# Altium project PCB_Project3.PrjPCB
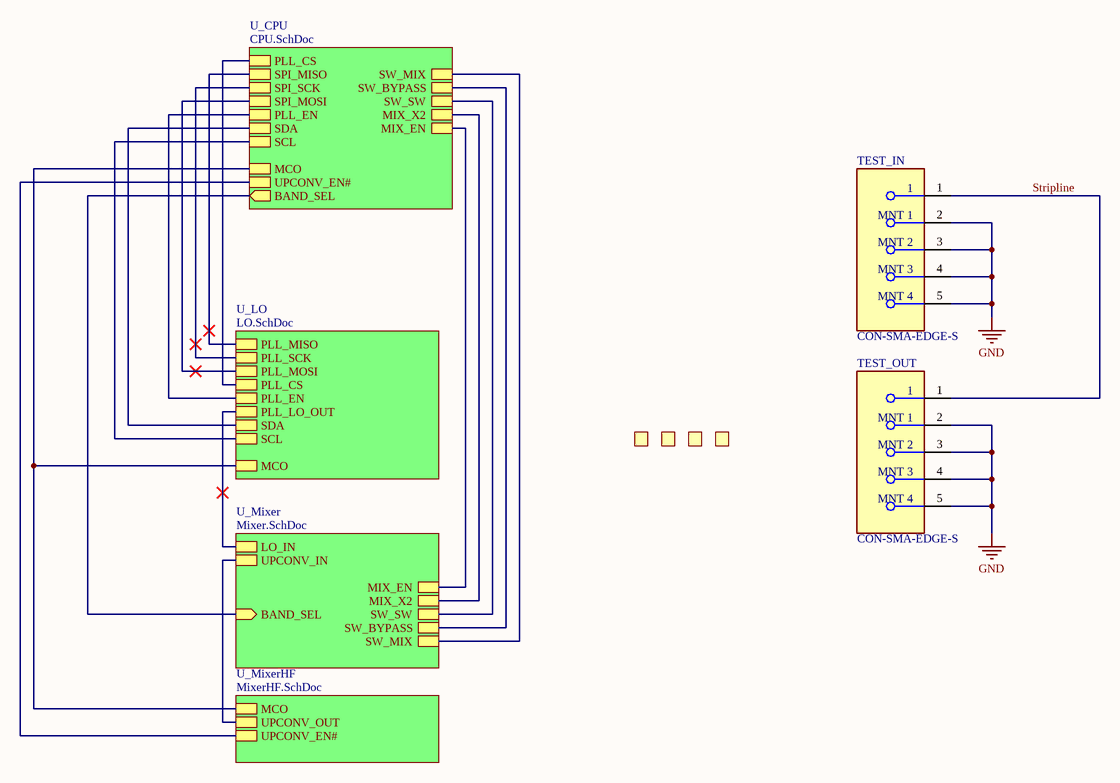
[diagram p0: Toplevel.SchDoc]
4 sheets, 115 parts. Net scope: hierarchical (ports join the sheet entries above them; power ports are global).
Board files: imped_control.PcbDoc, Template2.PcbDoc, imped50.PcbDoc
Sheets:
  Toplevel.SchDoc
    U_CPU = CPU.SchDoc
    U_Mixer = Mixer.SchDoc
    U_LO = LO.SchDoc

## Sheet Toplevel.SchDoc
size A4

### Parts
H1  MOUNTHOLE_3MM  [MOUNT_3MM]  (value not drawn)
H2  MOUNTHOLE_3MM  [MOUNT_3MM]  (value not drawn)
H3  MOUNTHOLE_3MM  [MOUNT_3MM]  (value not drawn)
H4  MOUNTHOLE_3MM  [MOUNT_3MM]  (value not drawn)
TEST_IN  CON-SMA-EDGE-S  [FP-CON-SMA-EDGE-S-MFG]
TEST_OUT  CON-SMA-EDGE-S  [FP-CON-SMA-EDGE-S-MFG]

### Sub-sheets
U_CPU = CPU.SchDoc: PLL_CS, SPI_MISO, SPI_SCK, SPI_MOSI, PLL_EN, SDA, SCL, MCO, UPCONV_EN#, SW_MIX, SW_BYPASS, SW_SW, MIX_X2, MIX_EN, BAND_SEL (out)
U_LO = LO.SchDoc: PLL_MISO, PLL_SCK, PLL_MOSI, PLL_CS, PLL_EN, PLL_LO_OUT, SDA, SCL, MCO
U_Mixer = Mixer.SchDoc: LO_IN, UPCONV_IN, MIX_EN, MIX_X2, SW_SW, SW_BYPASS, SW_MIX, BAND_SEL (in)
U_MixerHF = MixerHF.SchDoc (file not in this document): MCO, UPCONV_OUT, UPCONV_EN#

### Nets
GND: TEST_IN.2(MNT_1) TEST_IN.3(MNT_2) TEST_IN.4(MNT_3) TEST_IN.5(MNT_4) TEST_OUT.2(MNT_1) TEST_OUT.3(MNT_2) TEST_OUT.4(MNT_3) TEST_OUT.5(MNT_4)
BAND_SEL: sheet U_CPU/BAND_SEL, sheet U_Mixer/BAND_SEL
CPU_SCL: sheet U_CPU/SCL, sheet U_LO/SCL
CPU_SDA: sheet U_CPU/SDA, sheet U_LO/SDA
CS_PLL: sheet U_CPU/PLL_CS, sheet U_LO/PLL_CS
LO+: sheet U_Mixer/LO_IN, sheet U_LO/PLL_LO_OUT
MCO: sheet U_CPU/MCO, sheet U_MixerHF/MCO, sheet U_LO/MCO
MIX_EN: sheet U_CPU/MIX_EN, sheet U_Mixer/MIX_EN
MIX_X2: sheet U_CPU/MIX_X2, sheet U_Mixer/MIX_X2
MOSI: sheet U_CPU/SPI_MOSI, sheet U_LO/PLL_MOSI
PLL_EN: sheet U_CPU/PLL_EN, sheet U_LO/PLL_EN
PLL_MISO: sheet U_CPU/SPI_MISO, sheet U_LO/PLL_MISO
SCK: sheet U_CPU/SPI_SCK, sheet U_LO/PLL_SCK
Stripline: TEST_IN.1 TEST_OUT.1
SW_BYPASS: sheet U_CPU/SW_BYPASS, sheet U_Mixer/SW_BYPASS
SW_MIX: sheet U_CPU/SW_SW, sheet U_Mixer/SW_SW
SW_MIX_CPU: sheet U_CPU/SW_MIX, sheet U_Mixer/SW_MIX
UPCONV_EN#: sheet U_CPU/UPCONV_EN#, sheet U_MixerHF/UPCONV_EN#
UPCONV_IN: sheet U_Mixer/UPCONV_IN, sheet U_MixerHF/UPCONV_OUT

### Library data of the parts
TEST_IN TEST_OUT = CMP-204357-000001-1: CONN SMA JACK STR EDGE MNT; Manufacturer: RF Solutions Ltd.; Impedance: 50Ω; Conn Orientation: Right Angle; Is Female: yes; Number Of Contacts: 1; Frequency: 18GHz; Shielding: true; Category: Conn; ComponentLink2URL: https://www.rfsolutions.co.uk/downloads/1498648656DS-CON-EDGE-SMA-4.pdf; Octopart: https://octopart.com/con-sma-edge-s-rf+solutions-70967450; Package: CONN_JACK; Manufacturer Part Number: CON-SMA-EDGE-S; Height: 6.35mm; Device Class L1: Connectors; Footprint Url: https://forum.upverter.com/uploads/default/original/3X/b/e/be75b907af57498775929d6d9099689c472e0307.pdf; Contact Material: Gold; ComponentLink2Description: Datasheet; Device Class L2: RF / Coaxial Connectors; RoHS: TRUE; Device Class L3: unset; Digikey Description: CONN SMA JACK STR EDGE MNT; Lead Free: Yes; Automotive: No

## Sheet CPU.SchDoc
size A4
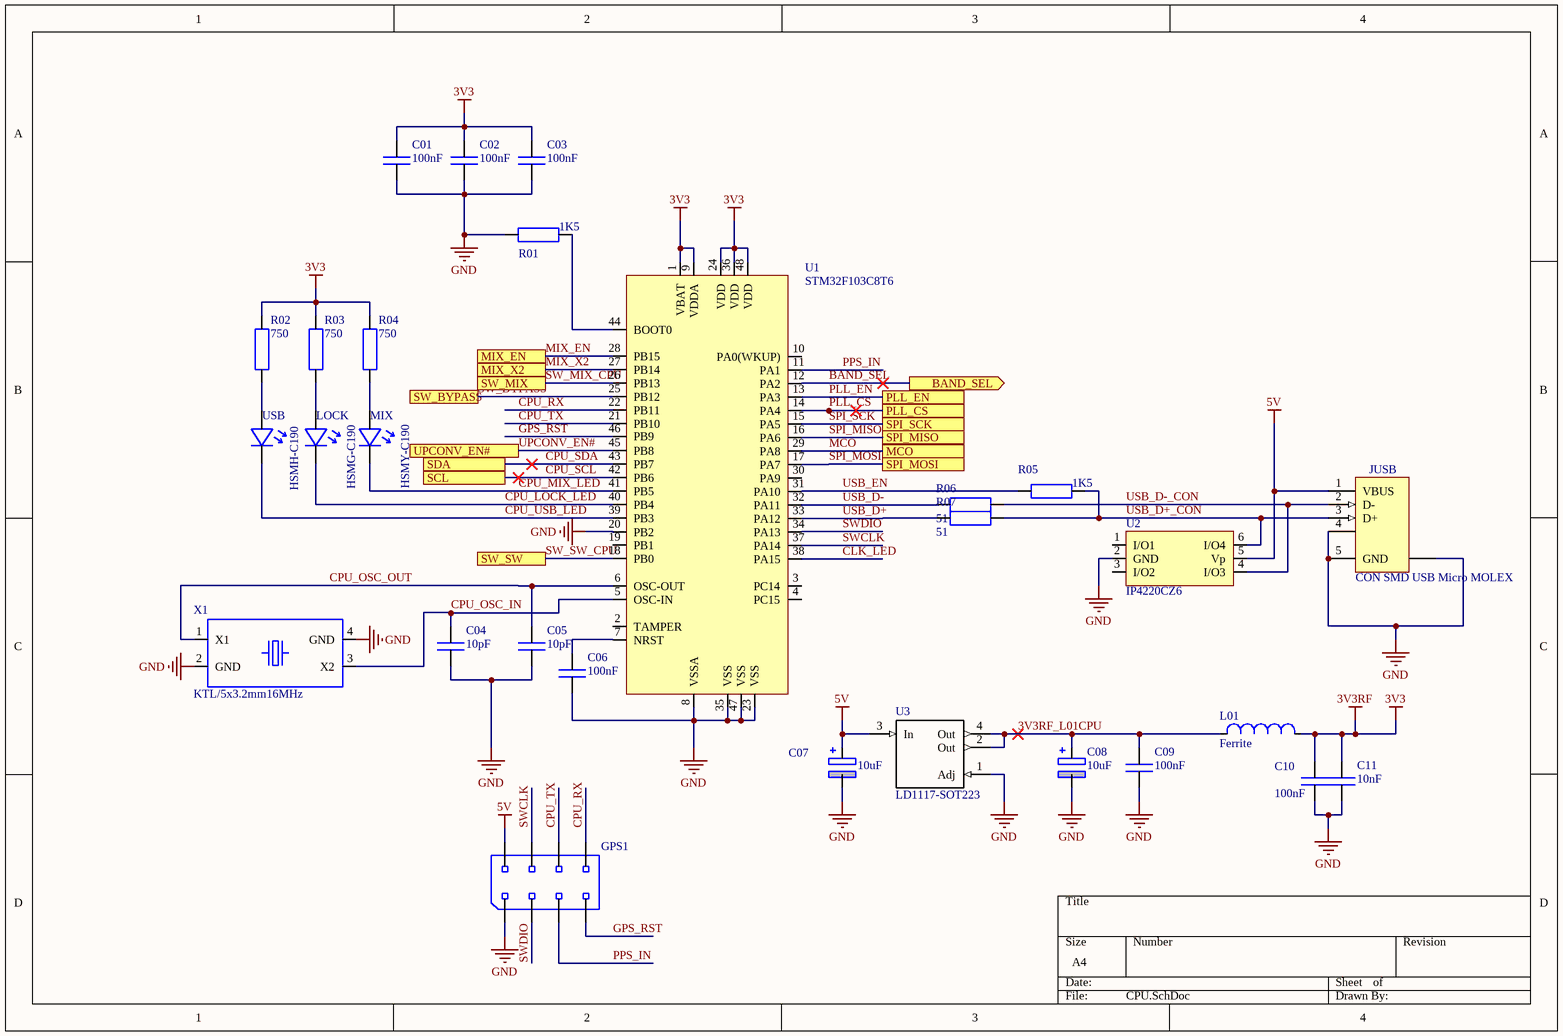
[diagram p1: CPU.SchDoc]

### Parts
C01  100nF  [smd C0603_0.80]
C02  100nF  [smd C0603_0.80]
C03  100nF  [smd C0603_0.80]
C04  10pF  [smd C0603_0.80]
C05  10pF  [smd C0603_0.80]
C06  100nF  [smd C0603_0.80]
C07  10uF  [smd C1206 polar]
C08  10uF  [smd C1206 polar]
C09  100nF  [smd C0603_0.80]
C10  100nF  [smd C0603_0.80]
C11  10nF  [smd C0603_0.80]
GPS1  (no value)  [hdr 2x4]
JUSB  CON SMD USB Micro MOLEX  [SMD USB MOLEX]
L01  Ferrite  [smd C0805]
LOCK  HSMG-C190  [led HSMH-C190 (Avago Technologies)]
MIX  HSMY-C190  [led HSMH-C190 (Avago Technologies)]
R01  1K5  [smd C0603_0.45]
R02  750  [smd C0603_0.45]
R03  750  [smd C0603_0.45]
R04  750  [smd C0603_0.45]
R05  1K5  [smd C0603_0.45]
R06  51  [smd C0603_0.45]
R07  51  [smd C0603_0.45]
U1  STM32F103C8T6  [TSQFP50P900X900X160-48N]
U2  IP4220CZ6  [smd SOT-457]
U3  LD1117-SOT223  [SOT223]
USB  HSMH-C190  [led HSMH-C190 (Avago Technologies)]
X1  KTL/5x3.2mm16MHz  [smd KTL 5x3.2]

### Ports
BAND_SEL (out), MCO, MIX_EN, MIX_X2, PLL_CS, PLL_EN, SCL, SDA, SPI_MISO, SPI_MOSI, SPI_SCK, SW_BYPASS, SW_MIX, SW_SW, UPCONV_EN#

### Nets
3V3: C01.2 C02.2 C03.2 C10.2 C11.2 L01.2 R02.2 R03.2 R04.2 U1.1(VBAT) U1.9(VDDA) U1.24(VDD) U1.36(VDD) U1.48(VDD)  [also labelled 3V3RF]
5V: C07.1 GPS1.2 JUSB.1(VBUS) U2.5(Vp) U3.3(In)
GND: C01.1 C02.1 C03.1 C04.1 C05.1 C06.1 C07.2 C08.2 C09.1 C10.1 C11.1 GPS1.1 JUSB.4(GND) JUSB.5(GND) JUSB.6(SHLD) R01.1 U1.8(VSSA) U1.20(PB2) U1.23(VSS) U1.35(VSS) U1.47(VSS) U2.2(GND) U3.1(Adj) X1.2(GND) X1.4(GND)
3V3RF_L01CPU: C08.1 C09.2 L01.1 U3.2(Out) U3.4(Out)
BAND_SEL: U1.12(PA2) ; port BAND_SEL
CLK_LED: U1.38(PA15)
CPU_LOCK_LED: LOCK.2 U1.40(PB4)
CPU_MIX_LED: MIX.2 U1.41(PB5)
CPU_OSC_IN: C04.2 U1.5(OSC-IN) X1.3(X2)
CPU_OSC_OUT: C05.2 U1.6(OSC-OUT) X1.1(X1)
CPU_RX: GPS1.8 U1.22(PB11)
CPU_SCL: U1.42(PB6) ; port SCL
CPU_SDA: U1.43(PB7) ; port SDA
CPU_TX: GPS1.6 U1.21(PB10)
CPU_USB_LED: U1.39(PB3) USB.2
GPS_RST: GPS1.7 U1.46(PB9)
MCO: U1.29(PA8) ; port MCO
MIX_EN: U1.28(PB15) ; port MIX_EN
MIX_X2: U1.27(PB14) ; port MIX_X2
PLL_CS: U1.14(PA4) ; port PLL_CS  [project net CS_PLL]
PLL_EN: U1.13(PA3) ; port PLL_EN
PPS_IN: GPS1.5 U1.11(PA1)
SPI_MISO: U1.16(PA6) ; port SPI_MISO  [project net PLL_MISO]
SPI_MOSI: U1.17(PA7) ; port SPI_MOSI  [project net MOSI]
SPI_SCK: U1.15(PA5) ; port SPI_SCK  [project net SCK]
SW_BYPASS: U1.25(PB12) ; port SW_BYPASS
SW_MIX_CPU: U1.26(PB13) ; port SW_MIX
SW_SW_CPU: U1.18(PB0) ; port SW_SW  [project net SW_MIX]
SWCLK: GPS1.4 U1.37(PA14)
SWDIO: GPS1.3 U1.34(PA13)
UPCONV_EN#: U1.45(PB8) ; port UPCONV_EN#
USB_D+: R07.1 U1.33(PA12)
USB_D+_CON: JUSB.3(D+) R05.2 R07.2 U2.6(I/O4)
USB_D-: R06.1 U1.32(PA11)
USB_D-_CON: JUSB.2(D-) R06.2 U2.4(I/O3)
USB_EN: R05.1 U1.31(PA10)
NetC06_2: C06.2 U1.7(NRST)
NetLOCK_1: LOCK.1 R03.1
NetMIX_1: MIX.1 R04.1
NetR01_2: R01.2 U1.44(BOOT0)
NetR02_1: R02.1 USB.1

Not connected (* = marked no-connect by the designer): U1 2(TAMPER) 3(PC14) 4(PC15) 10(PA0(WKUP)) 19(PB1) 30(PA9); U2 1(I/O1) 3(I/O2)

### Library data of the parts
C01 C02 C03 C06 C09 C10 = CSMD603/100nF: smd capaciteit, verp.0603, 100nF; Part Number: CSMD603/100nF; Component Kind: Standard; Component Type: Standard; Designator: CSMD603/100nF; Pin Count: 2; Supplier 1: Farnell
C04 C05 = CSMD603/10pF: smd capaciteit, verp.0603, 10pF; Part Number: CSMD603/10pF; Component Kind: Standard; Component Type: Standard; Designator: CSMD603/10pF; Pin Count: 2; Supplier 1: Farnell
C07 C08 = CSMD1206/10uF/10V: smd capaciteit, tantalium, verp.1206, 10uF/10V; Part Number: CSMD1206/10uF/10V; Component Kind: Standard; Component Type: Standard; Designator: CSMD1206/10uF/10V; Pin Count: 2; Supplier 1: Farnell
C11 = CSMD603/10nF: smd capaciteit, verp.0603, 10nF; Part Number: CSMD603/10nF; Component Kind: Standard; Component Type: Standard; Pin Count: 2; Supplier 1: Farnell
GPS1 = CON HDR 2x4: pcb header recht 2x4  pitch 100mil; Part Number: CON HDR 2x4; Component Kind: Standard; Component Type: Standard; Designator: CON HDR 2x4; Pin Count: 8; Supplier 1: Farnell
JUSB = CON SMD USB Micro MOLEX: MOLEX - 47589-0001 - MICRO USB TYPE AB; Supplier 1: Farnell
L01 = Ferrite 0805: Ferrite bead, 0805 package; Supplier 1: Farnell
LOCK = HSMG-C190: led smd groen, Avago Techn., HSMG-C190; Supplier 1: Farnell
MIX = HSMY-C190: led smd geel, Avago Techn., HSMY-C190; Supplier 1: Farnell
R01 R05 = 1K5/603: weerstand SMD603, 1K5; Supplier 1: Farnell
R02 R03 R04 = 750R/603: weerstand SMD603, 750R; Supplier 1: Farnell
R06 R07 = 51R/603: weerstand SMD603, 51R; Supplier 1: Farnell
U1 = STM32F100xx
U2 = IP4220CZ6: Dual USB 2.0 integrated ESD protection; Supplier 1: Farnell
USB = HSMH-C190: led smd rood, Avago Techn., HSMH-C190; Supplier 1: Farnell
X1 = KTL/5x3.2mm 16MHz: TXC Xtal 16.000 MHz, 5x3.2mm; Part Number: KTL/5x3.2mm 16MHz; Component Kind: Standard; Component Type: Standard; Designator: KTL/5x3.2mm 16MHz; Pin Count: 4; Supplier 1: Farnell

## Sheet Mixer.SchDoc
size A3
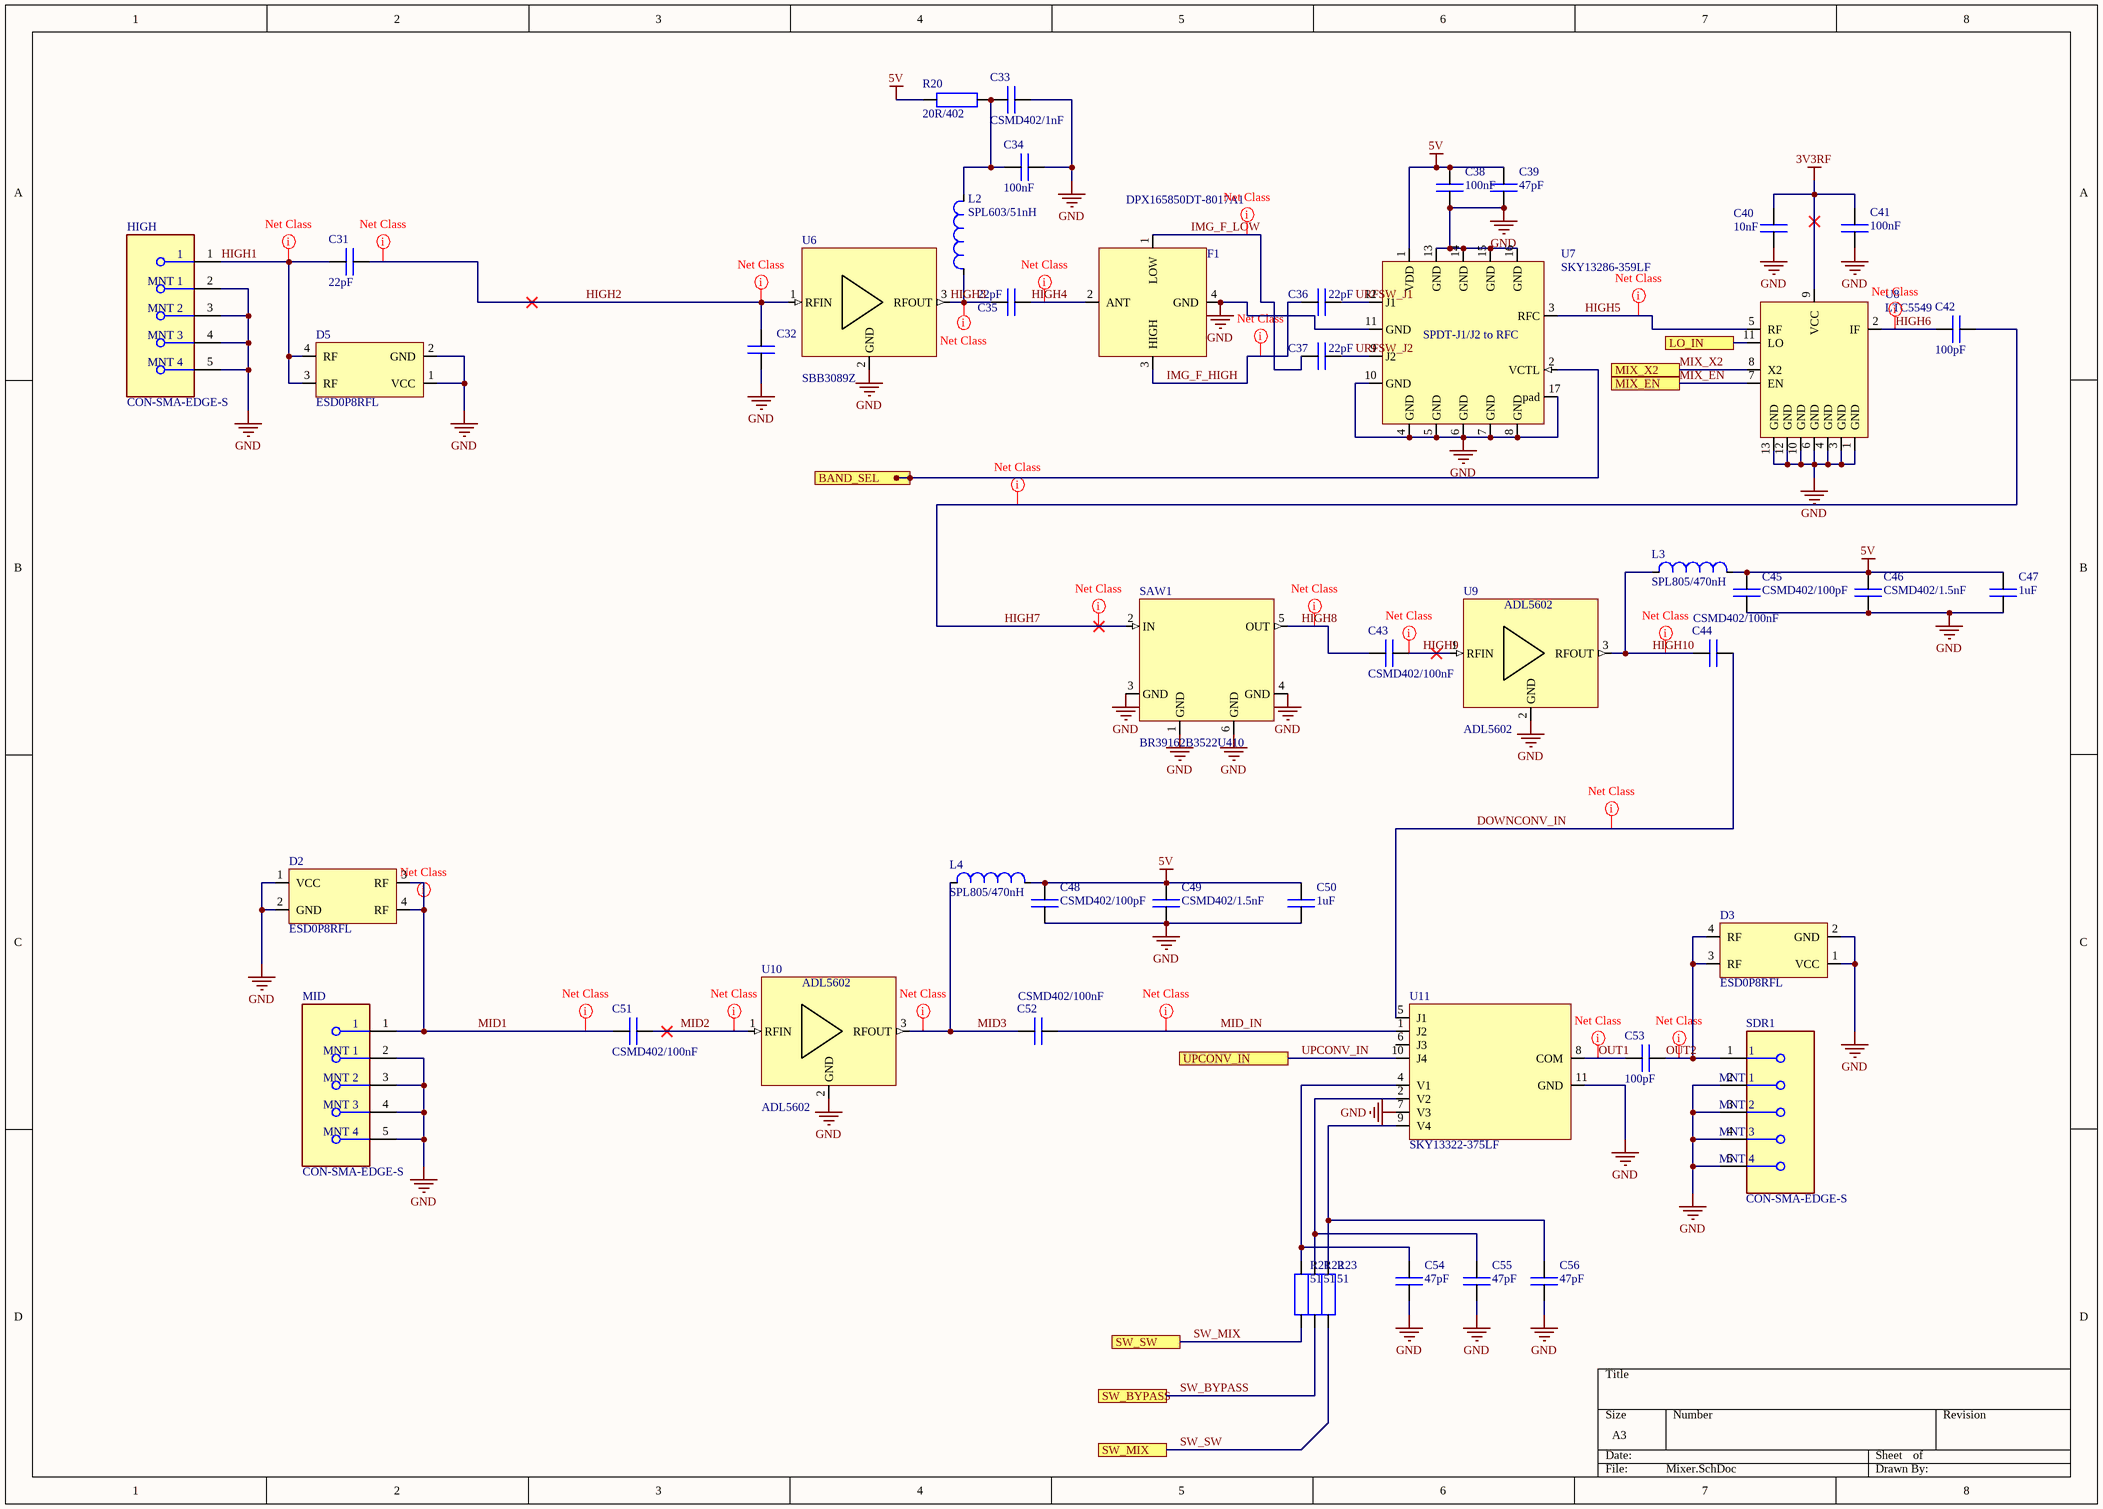
[diagram p2: Mixer.SchDoc]

### Parts
C31  22pF  [smd C0402]
C32  (no value)  [smd C0402]
C33  CSMD402/1nF  [smd C0402]
C34  100nF  [smd C0402]
C35  22pF  [smd C0402]
C36  22pF  [smd C0402]
C37  22pF  [smd C0402]
C38  100nF  [smd C0402]
C39  47pF  [smd C0402]
C40  10nF  [smd C0402]
C41  100nF  [smd C0402]
C42  100pF  [smd C0402]
C43  CSMD402/100nF  [smd C0402]
C44  CSMD402/100nF  [smd C0402]
C45  CSMD402/100pF  [smd C0402]
C46  CSMD402/1.5nF  [smd C0402]
C47  1uF  [smd C0603_0.80]
C48  CSMD402/100pF  [smd C0402]
C49  CSMD402/1.5nF  [smd C0402]
C50  1uF  [smd C0603_0.80]
C51  CSMD402/100nF  [smd C0402]
C52  CSMD402/100nF  [smd C0402]
C53  100pF  [smd C0402]
C54  47pF  [smd C0402]
C55  47pF  [smd C0402]
C56  47pF  [smd C0402]
D2  ESD0P8RFL  [ESD0P8RFL]
D3  ESD0P8RFL  [ESD0P8RFL]
D5  ESD0P8RFL  [ESD0P8RFL]
F1  DPX165850DT-8017A1  [DPX165850DT-8017A1]
HIGH  CON-SMA-EDGE-S  [FP-CON-SMA-EDGE-S-MFG]
L2  SPL603/51nH  [smd C0603]
L3  SPL805/470nH  [smd C0805]
L4  SPL805/470nH  [smd C0805]
MID  CON-SMA-EDGE-S  [FP-CON-SMA-EDGE-S-MFG]
R20  20R/402  [smd C0402_0.35]
R21  51  [smd C0402_0.35]
R22  51  [smd C0402_0.35]
R23  51  [smd C0402_0.35]
SAW1  BR39162B3522U410  [SAW_package]
SDR1  CON-SMA-EDGE-S  [FP-CON-SMA-EDGE-S-MFG]
U6  SBB3089Z  [LFCSP]
U7  SKY13286-359LF  [QFN-16_skyworks]
U8  LTC5549  [LTC5549]
U9  ADL5602  [LFCSP]
U10  ADL5602  [LFCSP]
U11  SKY13322-375LF  [QFN50P200X300X80-10N]

### Ports
BAND_SEL (in), LO_IN, MIX_EN, MIX_X2, SW_BYPASS, SW_MIX, SW_SW, UPCONV_IN

### Nets
3V3RF: C40.2 C41.2 U8.9(VCC)  [project net 3V3]
5V: C38.2 C39.2 C45.1 C46.1 C47.2 C48.1 C49.1 C50.2 L3.2 L4.2 R20.1 U7.1(VDD)
GND: C32.1 C33.2 C34.1 C38.1 C39.1 C40.1 C41.1 C45.2 C46.2 C47.1 C48.2 C49.2 C50.1 C54.1 C55.1 C56.1 D2.1(VCC) D2.2(GND) D3.1(VCC) D3.2(GND) D5.1(VCC) D5.2(GND) F1.4(GND) HIGH.2(MNT_1) HIGH.3(MNT_2) HIGH.4(MNT_3) HIGH.5(MNT_4) MID.2(MNT_1) MID.3(MNT_2) MID.4(MNT_3) MID.5(MNT_4) SAW1.1(GND) SAW1.3(GND) SAW1.4(GND) SAW1.6(GND) SDR1.2(MNT_1) SDR1.3(MNT_2) SDR1.4(MNT_3) SDR1.5(MNT_4) U6.2(GND) U7.4(GND) U7.5(GND) U7.6(GND) U7.7(GND) U7.8(GND) U7.10(GND) U7.11(GND) U7.13(GND) U7.14(GND) U7.15(GND) U7.16(GND) U7.17(pad) U8.1(GND) U8.3(GND) U8.4(GND) U8.6(GND) U8.10(GND) U8.12(GND) U8.13(GND) U9.2(GND) U10.2(GND) U11.7(V3) U11.11(GND)
BAND_SEL: U7.2(VCTL) ; port BAND_SEL
DOWNCONV_IN: C44.2 U11.5(J1)
HIGH1: C31.2 D5.3(RF) D5.4(RF) HIGH.1
HIGH2: C31.1 C32.2 U6.1(RFIN)
HIGH3: C35.1 L2.1 U6.3(RFOUT)
HIGH4: C35.2 F1.2(ANT)
HIGH5: U7.3(RFC) U8.5(RF)
HIGH6: C42.1 U8.2(IF)
HIGH7: C42.2 SAW1.2(IN)
HIGH8: C43.1 SAW1.5(OUT)
HIGH9: C43.2 U9.1(RFIN)
HIGH10: C44.1 L3.1 U9.3(RFOUT)
IMG_F_HIGH: C36.1 F1.3(HIGH)
IMG_F_LOW: C37.1 F1.1(LOW)
LO+: U8.11(LO) ; port LO_IN
MID1: C51.1 D2.3(RF) D2.4(RF) MID.1
MID2: C51.2 U10.1(RFIN)
MID3: C52.1 L4.1 U10.3(RFOUT)
MID_IN: C52.2 U11.1(J2)
MIX_EN: U8.7(EN) ; port MIX_EN
MIX_X2: U8.8(X2) ; port MIX_X2
OUT1: C53.1 U11.8(COM)
OUT2: C53.2 D3.3(RF) D3.4(RF) SDR1.1
SW_BYPASS: R22.1 ; port SW_BYPASS
SW_MIX: R21.1 ; port SW_SW
SW_SW: R23.1 ; port SW_MIX  [project net SW_MIX_CPU]
UPCONV_IN: U11.10(J4) ; port UPCONV_IN
URFSW_J1: C36.2 U7.12(J1)
URFSW_J2: C37.2 U7.9(J2)
NetC33_1: C33.1 C34.2 L2.2 R20.2
NetC54_2: C54.2 R21.2 U11.4(V1)
NetC55_2: C55.2 R22.2 U11.2(V2)
NetC56_2: C56.2 R23.2 U11.9(V4)

Not connected (* = marked no-connect by the designer): U11 6(J3)

### Layout directives
net class RF: DOWNCONV_IN, HIGH1, HIGH2, HIGH3, HIGH4, HIGH5, HIGH6, HIGH7, HIGH8, HIGH9, HIGH10, IMG_F_HIGH, IMG_F_LOW, MID1, MID2, MID3, MID_IN, OUT1, OUT2

### Notes on the sheet
- (in symbol SKY13286-359LF) SPDT-J1/J2 to RFC

### Library data of the parts
C31 C35-C37 = CSMD402/22pF: smd capaciteit, verp.0402, 22pF; Part Number: CSMD402/22pF; Component Kind: Standard; Component Type: Standard; Designator: CSMD402/22pF; Pin Count: 2; Supplier 1: Farnell
C32 = CSMD402/1pF: smd capaciteit, verp.0402, 1pF; Part Number: CSMD402/100nF; Component Kind: Standard; Component Type: Standard; Library Reference: CSMD402/100nF; Pin Count: 2; Supplier 1: Farnell
C33 = CSMD402/1nF: smd capaciteit, verp.0402, 1nF; Part Number: CSMD402/1nF; Component Kind: Standard; Component Type: Standard; Designator: CSMD402/1nF; Pin Count: 2; Supplier 1: Farnell
C34 C38 C41 C43 C44 C51 C52 = CSMD402/100nF: smd capaciteit, verp.0402, 100nF; Part Number: CSMD402/100nF; Component Kind: Standard; Component Type: Standard; Pin Count: 2; Supplier 1: Farnell
  C43 C44 C51 C52: Designator: CSMD402/100nF
C39 = CSMD402/47pF: smd capaciteit, verp.0402, 47pF; Part Number: CSMD402/47pF; Component Kind: Standard; Component Type: Standard; Pin Count: 2; Supplier 1: Farnell
C40 = CSMD402/100nF: smd capaciteit, verp.0402, 10nF; Part Number: CSMD402/100nF; Component Kind: Standard; Component Type: Standard; Designator: CSMD402/100nF; Pin Count: 2; Supplier 1: Farnell
C42 C45 C48 C53-C56 = CSMD402/100pF: smd capaciteit, verp.0402, 100pF; Part Number: CSMD402/100pF; Component Kind: Standard; Component Type: Standard; Pin Count: 2; Supplier 1: Farnell
  C45 C48: Designator: CSMD402/100pF
C46 C49 = CSMD402/1.5nF: smd capaciteit, verp.0402, 1.5nF; Part Number: CSMD402/1.5nF; Component Kind: Standard; Component Type: Standard; Designator: CSMD402/1.5nF; Pin Count: 2; Supplier 1: Farnell
C47 C50 = CSMD603/1uF: smd capaciteit, verp.0603, 1uF; Part Number: CSMD603/18nF; Component Kind: Standard; Component Type: Standard; Designator: CSMD603/18nF; Library Reference: CSMD603/18nF; Pin Count: 2; Supplier 1: Farnell
HIGH MID SDR1 = CMP-204357-000001-1: as TEST_IN on sheet Toplevel; Category: Conn; ComponentLink2URL: https://www.rfsolutions.co.uk/downloads/1498648656DS-CON-EDGE-SMA-4.pdf; Octopart: https://octopart.com/con-sma-edge-s-rf+solutions-70967450; Package: CONN_JACK; Manufacturer Part Number: CON-SMA-EDGE-S; Height: 6.35mm; Device Class L1: Connectors; Footprint Url: https://forum.upverter.com/uploads/default/original/3X/b/e/be75b907af57498775929d6d9099689c472e0307.pdf; Contact Material: Gold; ComponentLink2Description: Datasheet; Device Class L2: RF / Coaxial Connectors; RoHS: TRUE; Device Class L3: unset; Digikey Description: CONN SMA JACK STR EDGE MNT; Lead Free: Yes; Automotive: No
L3 L4 = SPL805/470nH: smd spoel, verpakking 805, 470nH; Component Kind: Standard; Supplier 1: Farnell
R20 = 20R/402: weerstand SMD402, 20R; Supplier 1: Farnell
R21-R23 = 51R/402: weerstand SMD402, 51R; Supplier 1: Farnell
SAW1 = BR39162B3522U410: Saw Filter; Manufacturer part number: B39162B3522U410; Manufacturer: TDK
U6 = SBB3089Z: RF Amplifier; Manufacturer: rfmd/Qorvo; MPN: SBB3089ZSR
U7 = SKY13286-359LF: SPDT-J2/J1 to RFC; Manufacturer: Skyworks
U9 U10 = ADL5602: Gain block; Manufacturer part number: ADL5602ARKZ-R7; Manufacturer: Analog Devices
L2 = SPL603/51nH: Component Kind: Standard; Supplier 1: Farnell

## Sheet LO.SchDoc
size A4
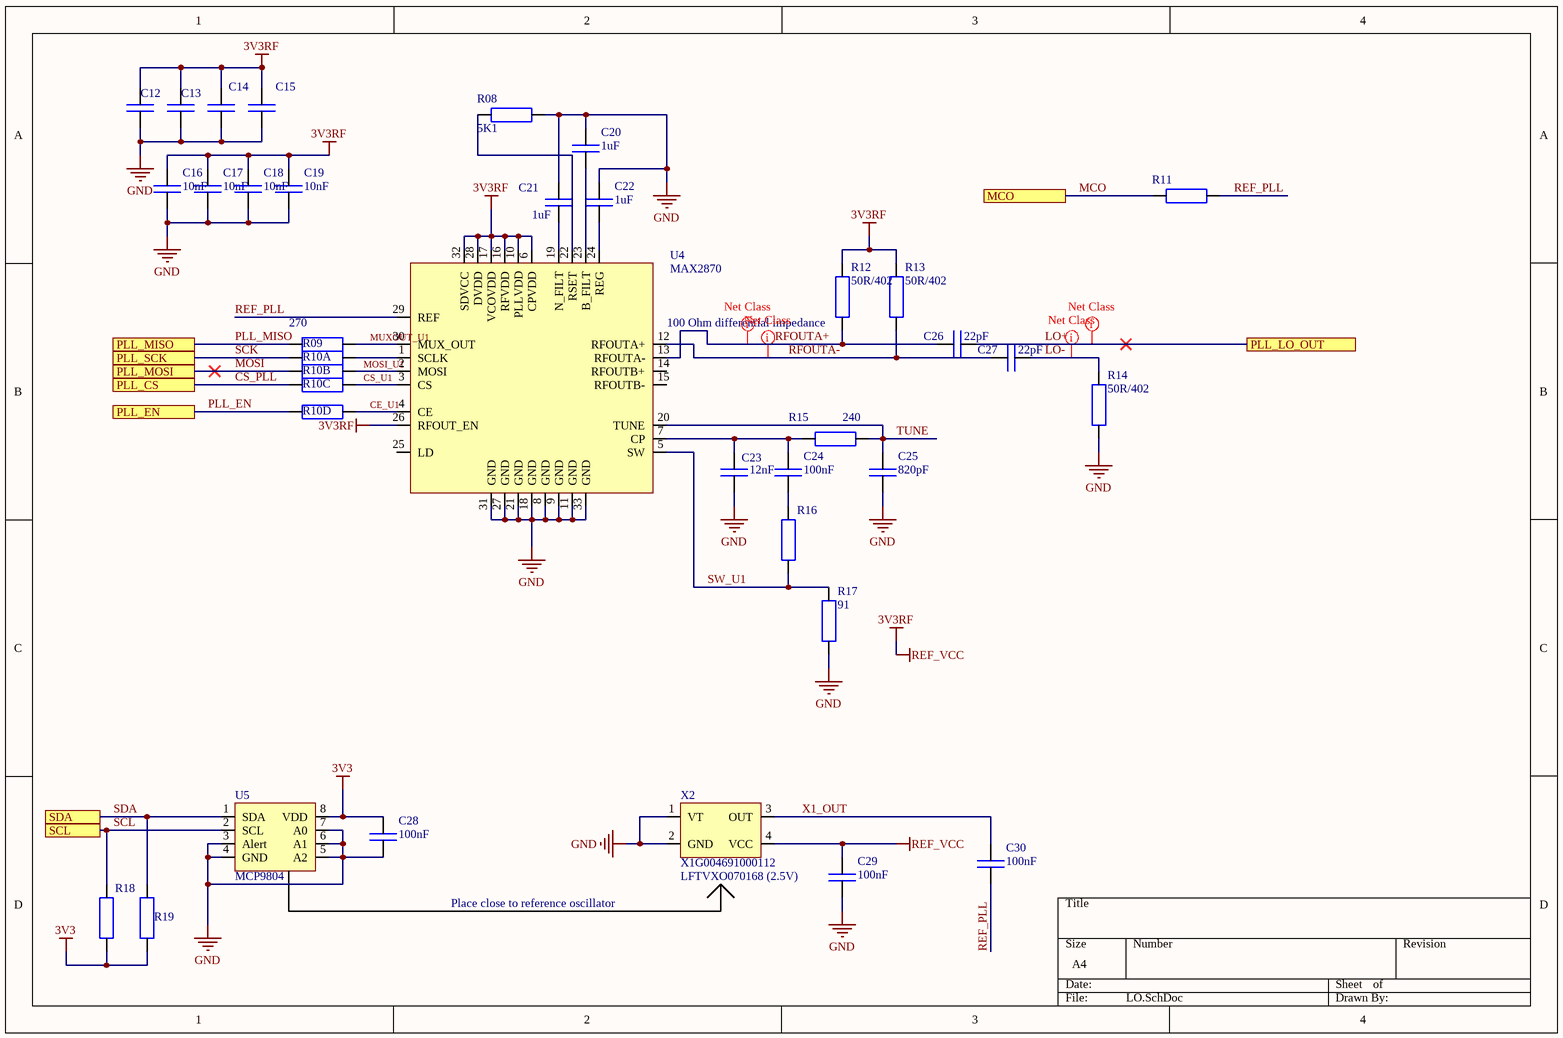
[diagram p3: LO.SchDoc]

### Parts
C12  100nF  [smd C0603_0.80]  (value not drawn)
C13  100nF  [smd C0603_0.80]  (value not drawn)
C14  100nF  [smd C0603_0.80]  (value not drawn)
C15  100nF  [smd C0603_0.80]  (value not drawn)
C16  10nF  [smd C0402]
C17  10nF  [smd C0402]
C18  10nF  [smd C0402]
C19  10nF  [smd C0402]
C20  1uF  [smd C0603_0.80]
C21  1uF  [smd C0603_0.80]
C22  1uF  [smd C0603_0.80]
C23  12nF  [smd C0603_0.80]
C24  100nF  [smd C0603_0.80]
C25  820pF  [smd C0603_0.80]
C26  22pF  [smd C0402]
C27  22pF  [smd C0402]
C28  100nF  [smd C0603_0.80]
C29  100nF  [smd C0603_0.80]
C30  100nF  [smd C0603_0.80]
R08  5K1  [smd C0603_0.45]
R09  270  [smd C0805_0.50]
R10  (no value)  [smd R EXB38v]  (parts A,B,C,D of 4)
R11  (no value)  [smd C0805_0.50]
R12  50R/402  [smd C0402_0.35]
R13  50R/402  [smd C0402_0.35]
R14  50R/402  [smd C0402_0.35]
R15  240  [smd C0603_0.45]
R16  (no value)  [smd C0603_0.45]
R17  91  [smd C0603_0.45]
R18  (no value)  [smd C0805_0.50]
R19  (no value)  [smd C0805_0.50]
U4  MAX2870  [MAXIM-T3255]
U5  MCP9804  [smd MSOP/8]
X2  X1G004691000112  [X1G004691000112]

### Ports
MCO, PLL_CS, PLL_EN, PLL_LO_OUT, PLL_MISO, PLL_MOSI, PLL_SCK, SCL, SDA

### Nets
3V3: C12.2 C13.2 C14.2 C15.2 C16.2 C17.2 C18.2 C19.2 C28.2 C29.2 R12.2 R13.2 R18.2 R19.1 U4.6(CPVDD) U4.10(PLLVDD) U4.16(RFVDD) U4.17(VCOVDD) U4.26(RFOUT_EN) U4.28(DVDD) U4.32(SDVCC) U5.8(VDD) X2.4(VCC)  [also labelled 3V3RF, REF_VCC]
GND: C12.1 C13.1 C14.1 C15.1 C16.1 C17.1 C18.1 C19.1 C20.1 C21.1 C22.1 C23.1 C25.1 C28.1 C29.1 R08.1 R14.1 R17.1 U4.8(GND) U4.9(GND) U4.11(GND) U4.18(GND) U4.21(GND) U4.27(GND) U4.31(GND) U4.33(GND) U5.3(Alert) U5.4(GND) U5.5(A2) U5.6(A1) U5.7(A0) X2.1(VT) X2.2(GND)
CE_U1: R10.8 U4.4(CE)
CS_PLL: R10.5 ; port PLL_CS
CS_U1: R10.6 U4.3(CS)
LO+: C26.2 ; port PLL_LO_OUT
LO-: C27.2 R14.2
MCO: R11.2 ; port MCO
MOSI: R10.3 ; port PLL_MOSI
MOSI_U1: R10.4 U4.2(MOSI)
MUXOUT_U1: R09.2 U4.30(MUX_OUT)
PLL_EN: R10.7 ; port PLL_EN
PLL_MISO: R09.1 ; port PLL_MISO
REF_PLL: C30.2 R11.1 U4.29(REF)
RFOUTA+: C26.1 R12.1 U4.13(RFOUTA-)
RFOUTA-: C27.1 R13.1 U4.12(RFOUTA+)
SCK: R10.1 ; port PLL_SCK
SCL: R18.1 U5.2(SCL) ; port SCL  [project net CPU_SCL]
SDA: R19.2 U5.1(SDA) ; port SDA  [project net CPU_SDA]
SW_U1: R16.1 R17.2 U4.5(SW)
TUNE: C25.2 R15.2 U4.20(TUNE)
X1_OUT: C30.1 X2.3(OUT)
NetC20_2: C20.2 U4.23(B_FILT)
NetC21_2: C21.2 U4.19(N_FILT)
NetC22_2: C22.2 U4.24(REG)
NetC23_2: C23.2 C24.2 R15.1 U4.7(CP)
NetC24_1: C24.1 R16.2
NetR08_2: R08.2 U4.22(RSET)
NetR10_2: R10.2 U4.1(SCLK)

Not connected (* = marked no-connect by the designer): U4 14(RFOUTB+) 15(RFOUTB-) 25(LD)

### Layout directives
net class RF: LO+, LO-, RFOUTA+, RFOUTA-

### Notes on the sheet
- (near R12) 100 Ohm differential impedance
- Place close to reference oscillator
- (near X2) LFTVXO070168 (2.5V)

### Library data of the parts
C12-C15 C24 C28-C30 = CSMD603/100nF: smd capaciteit, verp.0603, 100nF; Part Number: CSMD603/100nF; Component Kind: Standard; Component Type: Standard; Pin Count: 2; Supplier 1: Farnell
  C12-C15 C28-C30: Designator: CSMD603/100nF
C16-C19 = CSMD402/10nF: smd capaciteit, verp.0402, 10nF; Part Number: CSMD402/10nF; Component Kind: Standard; Component Type: Standard; Pin Count: 2; Supplier 1: Farnell
C20-C22 = CSMD603/1uF: as C47 on sheet Mixer; Component Kind: Standard; Component Type: Standard; Designator: CSMD603/18nF; Library Reference: CSMD603/18nF; Pin Count: 2
C23 = CSMD603/12nF: smd capaciteit, verp.0603, 12nF; Part Number: CSMD603/12nF; Component Kind: Standard; Component Type: Standard; Designator: CSMD603/12nF; Pin Count: 2
C25 = CSMD603/820pF: smd capaciteit, verp.0603, 820pF; Part Number: CSMD603/820pF; Component Kind: Standard; Component Type: Standard; Pin Count: 2; Supplier 1: Farnell
C26 C27 = CSMD402/22pF: smd capaciteit, verp.0402, 22pF; Part Number: CSMD402/22pF; Component Kind: Standard; Component Type: Standard; Designator: CSMD402/22pF; Pin Count: 2; Supplier 1: Farnell
R08 = 5K1/603: weerstand SMD603, 5K1
R09 R11 = 270R/805: weerstand SMD805, 270R
R10 = 22R/Network4/603: weerstandsnetwerk SMD603, 4x 22R; Supplier 1: Farnell
R12-R14 = 50R/402: weerstand SMD402, 50R; Supplier 1: Farnell
R15 = 240K/603: weerstand SMD603, 240K
R16 = 30R/603: weerstand SMD603, 30R; Supplier 1: Farnell
R17 = 91R/603: weerstand SMD603, 91R; Supplier 1: Farnell
R18 R19 = 1K8/805: weerstand SMD805, 1K8
U5 = MCP9804: ±0.25°C Typical Accuracy Digital Temperature Sensor; Supplier 1: Farnell

## Nets that join several sheets
3V3: CPU (14 pins), Mixer (C40.2 C41.2 U8.9), LO (23 pins)
5V: CPU (5 pins), Mixer (12 pins)
GND: Toplevel (8 pins), CPU (25 pins), Mixer (63 pins), LO (33 pins)
BAND_SEL: CPU (U1.12), Mixer (U7.2)
CPU_SCL: CPU (U1.42), LO (R18.1 U5.2)
CPU_SDA: CPU (U1.43), LO (R19.2 U5.1)
CS_PLL: CPU (U1.14), LO (R10.5)
LO+: Mixer (U8.11), LO (C26.2)
MCO: CPU (U1.29), LO (R11.2)
MIX_EN: CPU (U1.28), Mixer (U8.7)
MIX_X2: CPU (U1.27), Mixer (U8.8)
MOSI: CPU (U1.17), LO (R10.3)
PLL_EN: CPU (U1.13), LO (R10.7)
PLL_MISO: CPU (U1.16), LO (R09.1)
SCK: CPU (U1.15), LO (R10.1)
SW_BYPASS: CPU (U1.25), Mixer (R22.1)
SW_MIX: CPU (U1.18), Mixer (R21.1)
SW_MIX_CPU: CPU (U1.26), Mixer (R23.1)